# Altium schematic sheet keyless_door_Sheet.SchDoc
size A1
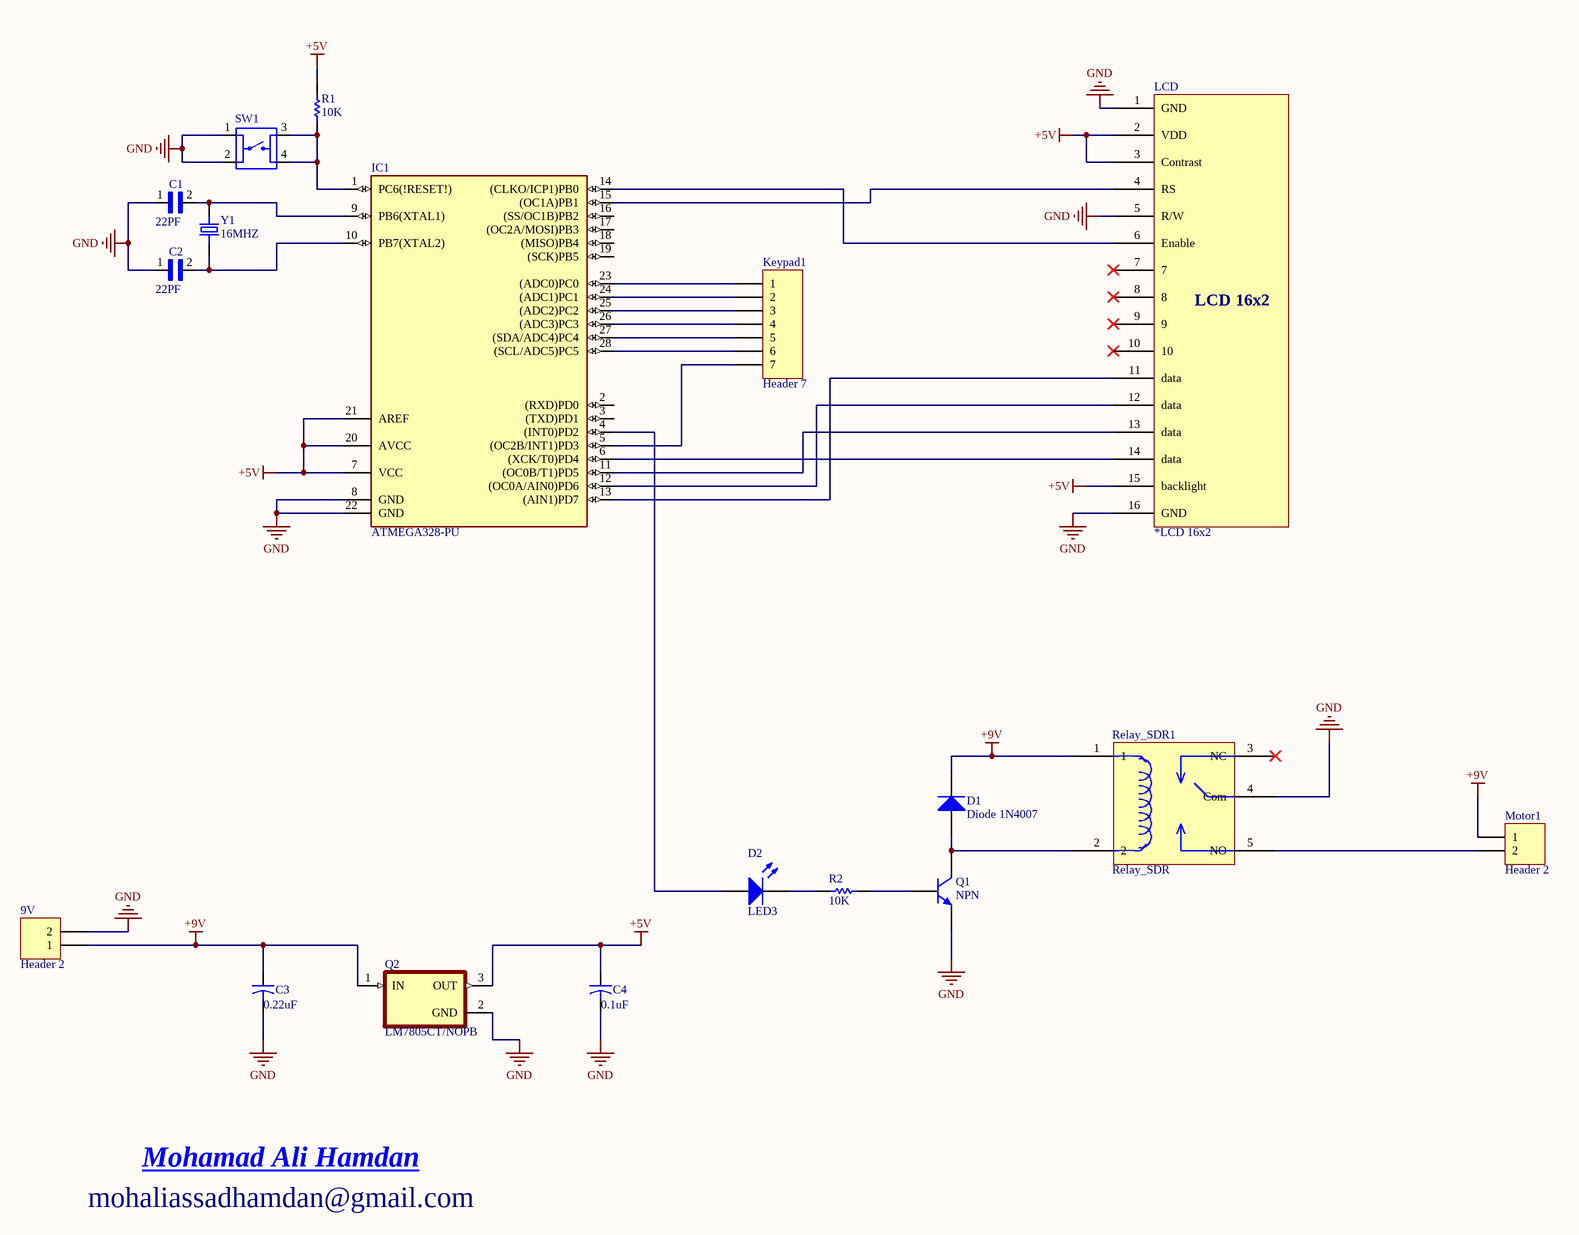
[diagram p0: keyless_door_Sheet.SchDoc]

## Parts
9V  Header 2  [9V_bat1]
C1  BuyPart: 22PF  [CAP_RDER71H333K0M1H03A]  (hidden comment: 14pF)
C2  BuyPart: 22PF  [CAP_RDER71H333K0M1H03A]  (hidden comment: 14pF)
C3  value 0.22uF  [Capacitor_polarized_100uF]  (hidden comment: Cap2)
C4  value 0.1uF  [Capacitor_polarized_100uF]  (hidden comment: Cap2)
D1  Diode 1N4007  [diode 4007]
D2  LED3  [LEDRD254W57D500H1070]
IC1  ATMEGA328-PU  [DIL28]
Keypad1  Header 7  [Keypad_4x3]
LCD  *LCD 16x2  [LCD_16_2]
Motor1  Header 2  [blue_connector_2pins]
Q1  NPN  [TO-226-AA]
Q2  LM7805CT/NOPB  [LM7805]
R1  value 10K  [resistor]  (hidden comment: Res1)
R2  value 10K  [resistor]  (hidden comment: Res1)
Relay_SDR1  Relay_SDR  [Relay_sdr]
SW1  FSM8JH  [SW_FSM8JH]  (value not drawn)
Y1  16MHZ  [XTAL_ECS-160-20-4VX]

## Nets
+5V: C4.1 IC1.7(VCC) IC1.20(AVCC) IC1.21(AREF) LCD.2(VDD) LCD.3(Contrast) LCD.15(backlight) Q2.3(OUT) R1.2
+9V: 9V.1 C3.1 D1.2(K) Motor1.1 Q2.1(IN) Relay_SDR1.1
GND: 9V.2 C1.1 C2.1 C3.2 C4.2 IC1.8(GND) IC1.22(GND) LCD.1(GND) LCD.5(R/W) LCD.16(GND) Q1.3(E) Q2.2(GND) Relay_SDR1.4(Com) SW1.1 SW1.2
NetC1_2: C1.2 IC1.9(PB6(XTAL1)) Y1.2
NetC2_2: C2.2 IC1.10(PB7(XTAL2)) Y1.1
NetD1_1: D1.1(A) Q1.1(C) Relay_SDR1.2
NetD2_1: D2.1(A) IC1.4((INT0)PD2)
NetD2_2: D2.2(K) R2.2
NetIC1_1: IC1.1(PC6(!RESET!)) R1.1 SW1.3 SW1.4
NetIC1_5: IC1.5((OC2B/INT1)PD3) Keypad1.7
NetIC1_6: IC1.6((XCK/T0)PD4) LCD.14(data)
NetIC1_11: IC1.11((OC0B/T1)PD5) LCD.13(data)
NetIC1_12: IC1.12((OC0A/AIN0)PD6) LCD.12(data)
NetIC1_13: IC1.13((AIN1)PD7) LCD.11(data)
NetIC1_14: IC1.14((CLKO/ICP1)PB0) LCD.6(Enable)
NetIC1_15: IC1.15((OC1A)PB1) LCD.4(RS)
NetIC1_23: IC1.23((ADC0)PC0) Keypad1.1
NetIC1_24: IC1.24((ADC1)PC1) Keypad1.2
NetIC1_25: IC1.25((ADC2)PC2) Keypad1.3
NetIC1_26: IC1.26((ADC3)PC3) Keypad1.4
NetIC1_27: IC1.27((SDA/ADC4)PC4) Keypad1.5
NetIC1_28: IC1.28((SCL/ADC5)PC5) Keypad1.6
NetMotor1_2: Motor1.2 Relay_SDR1.5(NO)
NetQ1_2: Q1.2(B) R2.1

Not connected (* = marked no-connect by the designer): IC1 2((RXD)PD0) 3((TXD)PD1) 16((SS/OC1B)PB2) 17((OC2A/MOSI)PB3) 18((MISO)PB4) 19((SCK)PB5); LCD 7* 8* 9* 10*; Relay_SDR1 3(NC)*

## Notes on the sheet
- Mohamad Ali Hamdan
- mohaliassadhamdan@gmail.com

## Library data of the parts
9V Motor1 = Header 2: Header, 2-Pin; LatestRevisionDate: 17-Jul-2002; LatestRevisionNote: Re-released for DXP Platform.; Publisher: Altium Limited
C1 C2 = RDER71H333K0M1H03A: Lead capacitor X7R(EIA) with Capacitance 33000pF, Rated Voltage 50Vdc; MF: Murata; SnapEDA_Link: https://www.snapeda.com/parts/RDER71H333K0M1H03A/Murata/view-part/4546735/?ref=snap; Availability: Warning; Price: None; Package: Radial Murata; Value: *; MP: RDER71H333K0M1H03A; Mouser-Purchase-URL: https://snapeda.com/shop?store=Mouser&id=4546735
C3 C4 = Cap2: Capacitor; pin to pad: 1>+ 2>-; Published: 23-Sep-2002; PackageReference: CAPR5-4X5; Publisher: Altium Limited; PackageDescription: Capacitor; 2 Leads
D1 = Diode 1N4007: 1 Amp General Purpose Rectifier; Published: 8-Jun-2000; LatestRevisionDate: 17-Jul-2002; LatestRevisionNote: Re-released for DXP Platform.; DatasheetVersion: 1998; PackageVersion: Aug-1999; PackageReference: DO-41; Publisher: Altium Limited; PackageDescription: Diode, Axial; Body 5.2 x 2.7 mm (LxDia. max), Lead Dia. 0.86 mm (max); Code_JEDEC: DO-204-AL; ComponentLink1Description: Manufacturer Link; ComponentLink1URL: http://www.fairchildsemi.com/; ComponentLink2Description: Datasheet; ComponentLink2URL: http://www.fairchildsemi.com/ds/1N%2F1N4001.pdf
D2 = LED3: Typical BLUE SiC LED; pin to pad: 1>A 2>C; Published: 8-Jun-2000; LatestRevisionDate: 17-Dec-2003; LatestRevisionNote: PCB Footprint replaced.; DatasheetVersion: 16-Apr-2002; PackageVersion: 16-Apr-2002; PackageReference: 3.5X2.8X1.9; Publisher: Altium Limited; PackageDescription: SM LED; 2 C-Bend Leads; Body 3.5 x 2.8 x 1.9 mm, inc leads (LxWxH typ)
IC1 = ATMEGA328-PU: AVR AVRÂ® ATmega Microcontroller IC 8-Bit 20MHz 32KB _16K x 16_ FLASH 28-PDIP; MF: Microchip Technology; Package: DIP-28 Microchip Technology; Price: None; Availability: Unavailable; MP: ATMEGA328-PU; SnapEDA_Link: https://www.snapeda.com/parts/ATMEGA328-PU/Microchip/view-part/4327846/?ref=snap; Value: *
Keypad1 = Header 7: Header, 7-Pin; LatestRevisionDate: 17-Jul-2002; LatestRevisionNote: Re-released for DXP Platform.; Publisher: Altium Limited
LCD = LCD 16x2
Q1 = NPN: NPN Bipolar Transistor; Published: 8-Jun-2000; LatestRevisionDate: 17-Jul-2002; LatestRevisionNote: Re-released for DXP Platform.; PackageReference: TO-226-AA; Publisher: Altium Limited; PackageDescription: TO, Flat Index; 3 In-Line, Axial Leads; Body Dia. 4.8mm; Leads 0.55 x 0.51 mm (max); Code_JEDEC: TO-226-AA
Q2 = LM7805CT/NOPB: Linear Voltage Regulator IC 1 Output 1A TO-220-3; MF: ON Semiconductor; MP: LM7805CT; SnapEDA_Link: https://www.snapeda.com/parts/LM7805CT/ON%20Semiconductor/view-part/546231/?ref=snap; Price: None; Package: TO-220 ON Semiconductor; Value: *; Availability: Unavailable
R1 R2 = Res1: Resistor; Published: 8-Jun-2000; LatestRevisionDate: 17-Jul-2002; LatestRevisionNote: Re-released for DXP Platform.; PackageReference: AXIAL-0.3; Publisher: Altium Limited; PackageDescription: Axial Device, Thru-Hole; 2 Leads; 0.3 in Pin Spacing
SW1 = FSM8JH: Tactile Switch SPST-NO Top Actuated Through Hole; MF: TE Connectivity; MP: FSM8JH; SnapEDA_Link: https://www.snapeda.com/parts/FSM8JH/TE%20Connectivity%20ALCOSWITCH%20Switches/view-part/139741/?ref=snap; Price: None; Package: None; TE_purchase_URL: https://www.te.com/usa-en/product-FSM8JH.html?te_bu=Cor&te_type=disp&te_campaign=seda_glo_cor-seda-global-disp-prtnr-fy19-seda-model-bom-cta_sma-317_1&elqCampaignId=32493; Value: *; Availability: Unavailable
Y1 = ECS-160-20-4VX: 16MHz Â±30ppm Crystal 20pF 50 Ohms HC-49/US; MF: ECS Inc.; SnapEDA_Link: https://www.snapeda.com/parts/ECS-160-20-4VX/ECS%20Inc./view-part/47293/?ref=snap; Availability: Unavailable; Value: *; Price: None; MP: ECS-160-20-4VX; Package: HC49/US ECS International